# Altium schematic sheet Memory.SchDoc: Memory
size A4; ApprovedBy: Muhammet YILDIZ; CheckedBy: Muhammet YILDIZ; Author: Muhammet YILDIZ; CompanyName: YıLDıZ IoT; DrawnBy: Muhammet YILDIZ; Engineer: Muhammet YILDIZ; Organization: YıLDıZ IoT; Address1: Elperek Mahallesi; Address2: Saray Sokak No:12; Address3: SAKARYA / TURKEY; Revision: 1; SheetNumber: 4; SheetTotal: 4; SheetSize: A4
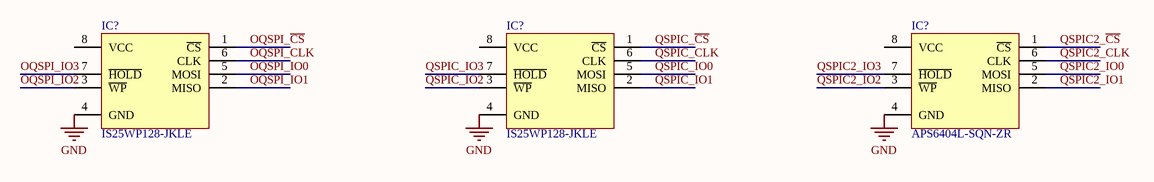
[diagram p0: Memory.SchDoc]

## Parts
(Parts that share a designator on the sheet are numbered #1, #2 ... from top to bottom, then left to right.)
IC?#1  IS25WP128-JKLE  [WINBOND WSON-8 6x5mm]
IC?#2  IS25WP128-JKLE  [WINBOND WSON-8 6x5mm]
IC?#3  APS6404L-SQN-ZR  [WINBOND WSON-8 6x5mm]

## Nets
GND: IC?#1.4(GND) IC?#2.4(GND) IC?#3.4(GND)
OQSPI_~{CS}: IC?#1.1(~{CS})
OQSPI_CLK: IC?#1.6(CLK)
OQSPI_IO0: IC?#1.5(MOSI)
OQSPI_IO1: IC?#1.2(MISO)
OQSPI_IO2: IC?#1.3(~{WP})
OQSPI_IO3: IC?#1.7(~{HOLD})
QSPIC2_~{CS}: IC?#3.1(~{CS})
QSPIC2_CLK: IC?#3.6(CLK)
QSPIC2_IO0: IC?#3.5(MOSI)
QSPIC2_IO1: IC?#3.2(MISO)
QSPIC2_IO2: IC?#3.3(~{WP})
QSPIC2_IO3: IC?#3.7(~{HOLD})
QSPIC_~{CS}: IC?#2.1(~{CS})
QSPIC_CLK: IC?#2.6(CLK)
QSPIC_IO0: IC?#2.5(MOSI)
QSPIC_IO1: IC?#2.2(MISO)
QSPIC_IO2: IC?#2.3(~{WP})
QSPIC_IO3: IC?#2.7(~{HOLD})

Not connected (* = marked no-connect by the designer): IC?#1 8(VCC); IC?#2 8(VCC); IC?#3 8(VCC)

## Notes on the sheet
- Title:
- Size:
- Project:
- Revision:
- Sheet
- of
- Date:
- YıLDıZ IoT
- Elperek Mahallesi
- Saray Sokak, No:12
- SAKARYA / TURKEY
- File:

## Library data of the parts
IC?#1 IC?#2 = WINBOND FLASH SPI 8PIN: NOR Flash Serial (SPI, Dual SPI, Quad SPI) 1.8V 128M-bit 16M x 8 8ns 8-Pin WSON EP; Manufacturer: ISSI; Density: 128Mb; Address Bus Width: 24b; Interface: SPI,Serial; Page Size: 256B; Supplier: Digi-Key; Supplier Part Number: 706-1624-ND; Manufacturer Part Number: IS25WP128-JKLE; RoHS: Yes; Category: Memory; Stock: 1395; Pricing: 1=2.11, 10=1.922, 25=1.8704, 40=1.86075, 80=1.66325, 230=1.65848, 570=1.63344, 1140=1.5641, 5130=1.45623 (USD); Pins: 8; Min Operating Temperature: -40°C; Max Operating Temperature: 105°C; Memory Format: NOR; Operating Supply Voltage: 1.8V; RoHS Compliant: Yes; ComponentLink1URL: http://www.mouser.com/ds/2/198/IS25WP032-064-128-737458.pdf?src-supplier=Mouser; ComponentLink1Description: http://www.mouser.com/ds/2/198/IS25WP032-064-128-737458.pdf?src-supplier=Mouser; ComponentLink2URL: http://www.issi.com/WW/pdf/IS25WP032-064-128.pdf?src-supplier=Avnet; ComponentLink2Description: http://www.issi.com/WW/pdf/IS25WP032-064-128.pdf?src-supplier=Avnet; ComponentLink3URL: http://www.issi.com/WW/pdf/25WP128.pdf?src-supplier=Digi-Key; ComponentLink3Description: http://www.issi.com/WW/pdf/25WP128.pdf?src-supplier=Digi-Key
IC?#3 = WINBOND FLASH SPI 8PIN: NOR Flash Serial (SPI, Dual SPI, Quad SPI) 1.8V 128M-bit 16M x 8 8ns 8-Pin WSON EP; Manufacturer: AP Memory; Supplier: Mouser; Supplier Part Number: 878-APS6404L-SQN-ZR; Manufacturer Part Number: APS6404L-SQN-ZR; RoHS: No; Stock: 4950; Pricing: 1=1.59, 10=1.46, 50=1.46, 100=1.26, 1000=1.19, 10000=0.985 (USD)